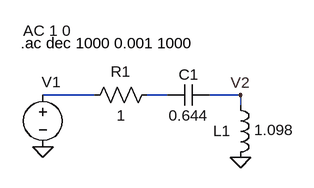
[diagram p0: schematic pasa_altos.asc]
pasa_altos.asc, the LTspice schematic file:
Version 4
SHEET 1 880 680
WIRE 48 112 -32 112
WIRE 160 112 128 112
WIRE 272 112 224 112
WIRE 272 128 272 112
FLAG 272 208 0
FLAG -32 192 0
FLAG 272 112 V2
SYMBOL res 144 96 R90
WINDOW 0 -5 56 VBottom 2
WINDOW 3 32 56 VTop 2
SYMATTR InstName R1
SYMATTR Value 1
SYMBOL ind 256 112 R0
WINDOW 0 -26 55 Left 2
WINDOW 3 37 54 Left 2
SYMATTR InstName L1
SYMATTR Value 1.098
SYMBOL cap 224 96 R90
WINDOW 0 0 32 VBottom 2
WINDOW 3 32 32 VTop 2
SYMATTR InstName C1
SYMATTR Value 0.644
SYMBOL voltage -32 96 R0
WINDOW 0 -2 -4 Left 2
WINDOW 3 15 -126 Left 2
WINDOW 123 -30 -83 Left 2
WINDOW 39 0 0 Left 0
SYMATTR InstName V1
SYMATTR Value ""
SYMATTR Value2 AC 1 0
TEXT -66 32 Left 2 !.ac dec 1000 0.001 1000

The netlist it stands for:
* pasa_altos.asc
R1 N002 N001 1
L1 V2 0 1.098
C1 V2 N002 0.644
V1 N001 0 AC 1 0
.ac dec 1000 0.001 1000
.backanno
.end